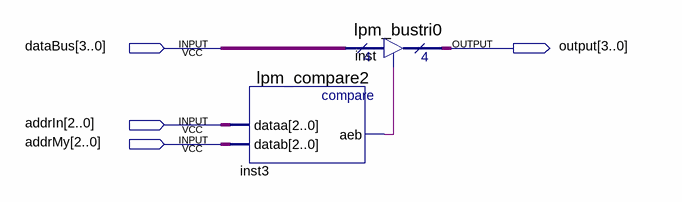
[diagram p0: schematic sheet]
// Quartus schematic slave.bdf as structural Verilog: 2 symbols, 4 pins
module slave (
  input  [3:0] dataBus,
  input  [2:0] addrIn,
  input  [2:0] addrMy,
  output [3:0] \output 
);

  wire inst3_aeb;

  lpm_compare2 inst3 (.dataa(addrIn), .datab(addrMy), .aeb(inst3_aeb));
  lpm_bustri0 inst (.enabledt(inst3_aeb), .data(dataBus), .tridata(\output ));
endmodule
